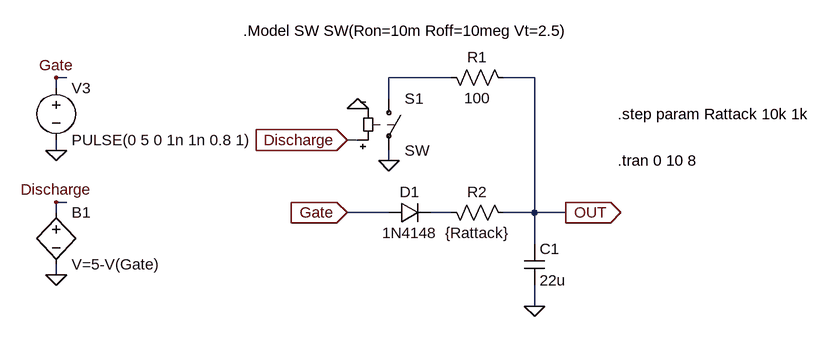
[diagram p0: schematic Arduino_EG_Charge_Test.asc]
Arduino_EG_Charge_Test.asc, the LTspice schematic file:
Version 4
SHEET 1 1520 724
WIRE 96 0 80 0
WIRE 688 0 592 0
WIRE 816 0 768 0
WIRE 80 16 80 0
WIRE 592 32 592 0
WIRE 544 96 528 96
WIRE 80 112 80 96
WIRE 592 128 592 112
WIRE 96 192 80 192
WIRE 80 208 80 192
WIRE 592 208 528 208
WIRE 688 208 656 208
WIRE 816 208 816 0
WIRE 816 208 768 208
WIRE 864 208 816 208
WIRE 816 256 816 208
WIRE 80 304 80 288
WIRE 816 352 816 320
FLAG 528 96 Discharge
IOPIN 528 96 In
FLAG 528 208 Gate
IOPIN 528 208 In
FLAG 816 352 0
FLAG 80 304 0
FLAG 80 192 Discharge
FLAG 80 0 Gate
FLAG 80 112 0
FLAG 864 208 OUT
IOPIN 864 208 Out
FLAG 592 128 0
FLAG 544 48 0
SYMBOL res 672 -16 M90
WINDOW 0 0 56 VBottom 2
WINDOW 3 32 56 VTop 2
SYMATTR InstName R1
SYMATTR Value 100
SYMBOL diode 592 224 R270
WINDOW 0 32 32 VTop 2
WINDOW 3 0 32 VBottom 2
SYMATTR InstName D1
SYMATTR Value 1N4148
SYMBOL res 672 192 M90
WINDOW 0 0 56 VBottom 2
WINDOW 3 32 56 VTop 2
SYMATTR InstName R2
SYMATTR Value {Rattack}
SYMBOL cap 800 256 R0
SYMATTR InstName C1
SYMATTR Value 22u
SYMBOL voltage 80 0 R0
WINDOW 123 0 0 Left 2
WINDOW 39 0 0 Left 2
SYMATTR InstName V3
SYMATTR Value PULSE(0 5 0 1n 1n 0.8 1)
SYMBOL bv 80 192 R0
SYMATTR InstName B1
SYMATTR Value V=5-V(Gate)
SYMBOL sw 592 16 R0
SYMATTR InstName S1
TEXT 944 56 Left 2 !.step param Rattack 10k 1k
TEXT 944 128 Left 2 !.tran 0 10 8
TEXT 368 -72 Left 2 !.Model SW SW(Ron=10m Roff=10meg Vt=2.5)

The netlist it stands for:
* Arduino_EG_Charge_Test.asc
R1 N001 OUT 100
D1 Gate N002 1N4148
R2 N002 OUT {Rattack}
C1 OUT 0 22u
V3 Gate 0 PULSE(0 5 0 1n 1n 0.8 1)
B1 Discharge 0 V=5-V(Gate)
S1 N001 0 Discharge 0 SW
.model D D
.lib standard.dio
.step param Rattack 10k 1k
.tran 0 10 8
.Model SW SW(Ron=10m Roff=10meg Vt=2.5)
.backanno
.end